# Altium schematic sheet 07_LMS3_Misc.SchDoc: LMS7002M misc (LMS1)
size A3; Organization: Lime Microsystems; Address1: Surrey Tech Centre; Address2: Guildford GU2 7YG; Address3: Surrey; Address4: United Kingdom; Revision: v1.0; SheetNumber: 7; SheetTotal: 31
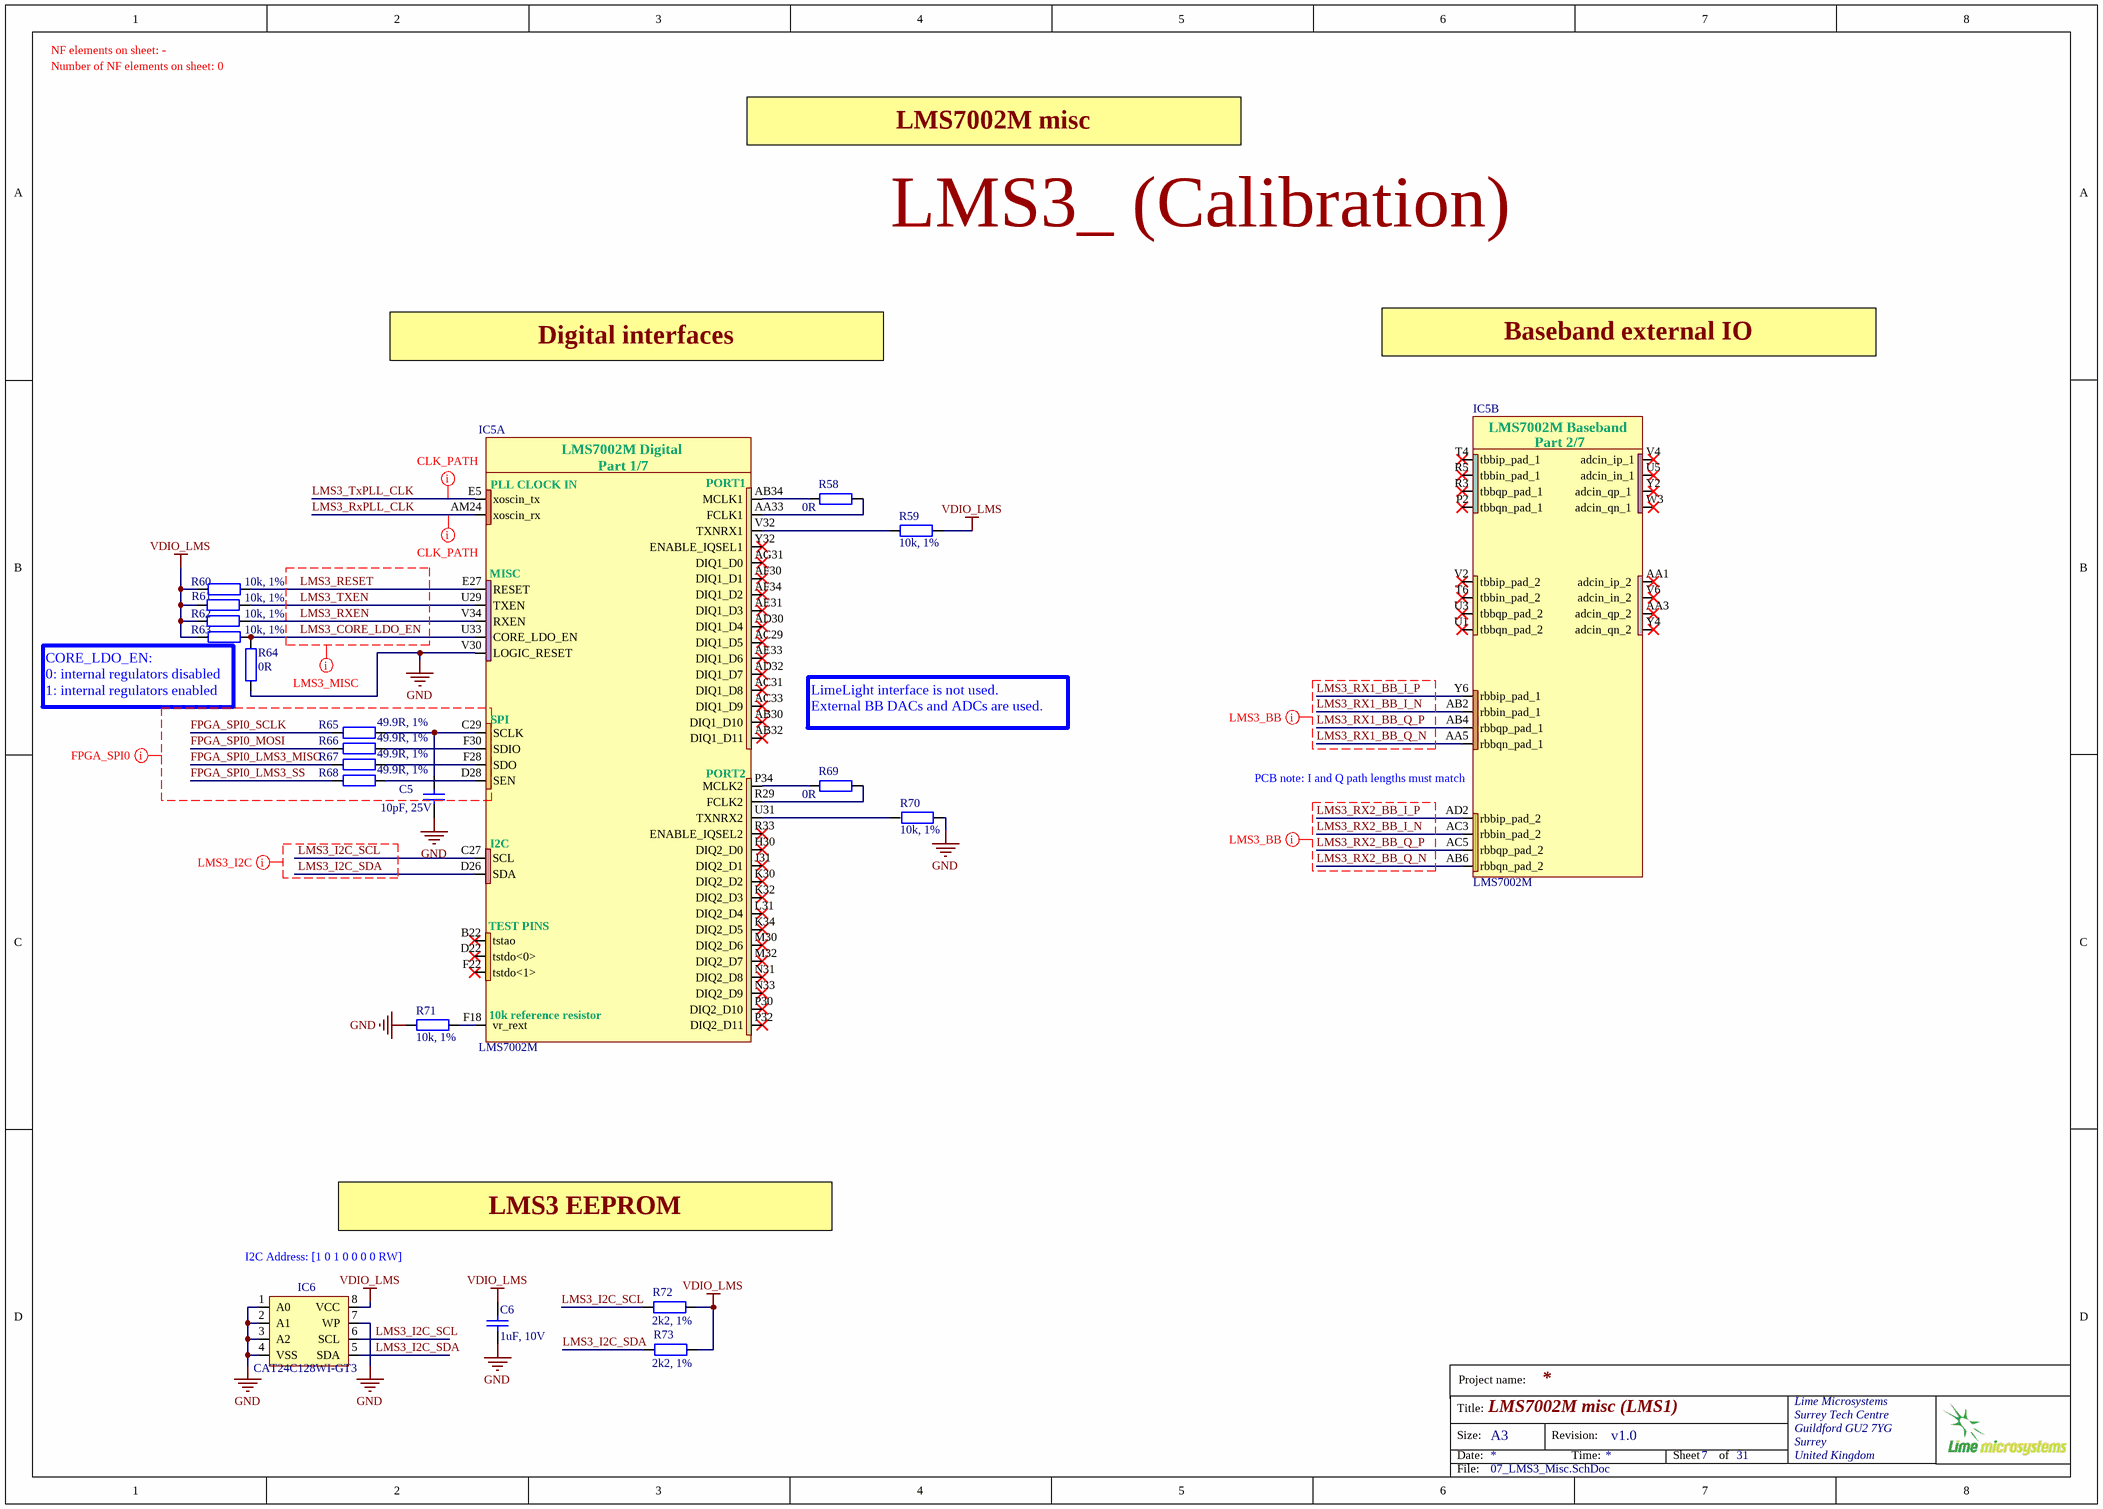
[diagram p0: 07_LMS3_Misc.SchDoc]

## Parts
C5  10pF, 25V  [CAP0402]
C6  1uF, 10V  [CAP0402]
IC5  LMS7002M  [LMS7002M_v5]  (parts A,B of 7)
IC6  CAT24C128WI-GT3  [SOIC127P600-8DL_v2]
R58  0R  [RES0402]
R59  10k, 1%  [RES0402]
R60  10k, 1%  [RES0402]
R61  10k, 1%  [RES0402]
R62  10k, 1%  [RES0402]
R63  10k, 1%  [RES0402]
R64  0R  [RES0402]
R65  49.9R, 1%  [RES0402]
R66  49.9R, 1%  [RES0402]
R67  49.9R, 1%  [RES0402]
R68  49.9R, 1%  [RES0402]
R69  0R  [RES0402]
R70  10k, 1%  [RES0402]
R71  10k, 1%  [RES0402]
R72  2k2, 1%  [RES0402]
R73  2k2, 1%  [RES0402]

## Nets
GND: C5.2 C6.2 IC5.V30(LOGIC_RESET) IC6.1(A0) IC6.2(A1) IC6.3(A2) IC6.4(VSS) IC6.7(WP) R64.1 R70.1 R71.2
VDIO_LMS: C6.1 IC6.8(VCC) R59.2 R60.2 R61.1 R62.1 R63.2 R72.1 R73.1
FPGA_SPI0_LMS3_MISO: R67.2
FPGA_SPI0_LMS3_SS: R68.2
FPGA_SPI0_MOSI: R66.2
FPGA_SPI0_SCLK: R65.2
LMS3_CORE_LDO_EN: IC5.U33(CORE_LDO_EN) R63.1 R64.2
LMS3_I2C_SCL: IC5.C27(SCL) IC6.6(SCL) R72.2
LMS3_I2C_SDA: IC5.D26(SDA) IC6.5(SDA) R73.2
LMS3_RESET: IC5.E27(RESET) R60.1
LMS3_RX1_BB_I_N: IC5.AB2(rbbin_pad_1)
LMS3_RX1_BB_I_P: IC5.Y6(rbbip_pad_1)
LMS3_RX1_BB_Q_N: IC5.AA5(rbbqn_pad_1)
LMS3_RX1_BB_Q_P: IC5.AB4(rbbqp_pad_1)
LMS3_RX2_BB_I_N: IC5.AC3(rbbin_pad_2)
LMS3_RX2_BB_I_P: IC5.AD2(rbbip_pad_2)
LMS3_RX2_BB_Q_N: IC5.AB6(rbbqn_pad_2)
LMS3_RX2_BB_Q_P: IC5.AC5(rbbqp_pad_2)
LMS3_RXEN: IC5.V34(RXEN) R62.2
LMS3_RxPLL_CLK: IC5.AM24(xoscin_rx)
LMS3_TXEN: IC5.U29(TXEN) R61.2
LMS3_TxPLL_CLK: IC5.E5(xoscin_tx)
NetC5_1: C5.1 IC5.C29(SCLK) R65.1
NetIC5_AA33: IC5.AA33(FCLK1) R58.2
NetIC5_AB34: IC5.AB34(MCLK1) R58.1
NetIC5_D28: IC5.D28(SEN) R68.1
NetIC5_F18: IC5.F18(vr_rext) R71.1
NetIC5_F28: IC5.F28(SDO) R67.1
NetIC5_F30: IC5.F30(SDIO) R66.1
NetIC5_P34: IC5.P34(MCLK2) R69.1
NetIC5_R29: IC5.R29(FCLK2) R69.2
NetIC5_U31: IC5.U31(TXNRX2) R70.2
NetIC5_V32: IC5.V32(TXNRX1) R59.1

Not connected (* = marked no-connect by the designer): IC5 AA1(adcin_ip_2_)* AA3(adcin_qp_2_)* AB30(DIQ1_D10)* AB32(DIQ1_D11)* AC29(DIQ1_D5)* AC31(DIQ1_D8)* AC33(DIQ1_D9)* AD30(DIQ1_D4)* AD32(DIQ1_D7)* AE31(DIQ1_D3)* AE33(DIQ1_D6)* AF30(DIQ1_D1)* AF34(DIQ1_D2)* AG31(DIQ1_D0)* B22(tstao)* D22(tstdo<0>)* F22(tstdo<1>)* H30(DIQ2_D0)* J31(DIQ2_D1)* K30(DIQ2_D2)* K32(DIQ2_D3)* K34(DIQ2_D5)* L31(DIQ2_D4)* M30(DIQ2_D6)* M32(DIQ2_D7)* N31(DIQ2_D8)* N33(DIQ2_D9)* P2(tbbqn_pad_1)* P30(DIQ2_D10)* P32(DIQ2_D11)* R3(tbbqp_pad_1)* R5(tbbin_pad_1)* R33(ENABLE_IQSEL2)* T4(tbbip_pad_1)* T6(tbbin_pad_2)* U1(tbbqn_pad_2)* U3(tbbqp_pad_2)* U5(adcin_in_1)* V2(tbbip_pad_2)* V4(adcin_ip_1)* V6(adcin_in_2_)* W3(adcin_qn_1_)* Y2(adcin_qp_1_)* Y4(adcin_qn_2_)* Y32(ENABLE_IQSEL1)*

## Layout directives
net class CLK_PATH: LMS3_RxPLL_CLK, LMS3_TxPLL_CLK
net class FPGA_SPI0: FPGA_SPI0_LMS3_MISO, FPGA_SPI0_LMS3_SS, FPGA_SPI0_MOSI, FPGA_SPI0_SCLK
net class LMS3_I2C: LMS3_I2C_SCL, LMS3_I2C_SDA
net class LMS3_MISC: LMS3_CORE_LDO_EN, LMS3_RESET, LMS3_RXEN, LMS3_TXEN
net class LMS3_BB: LMS3_RX1_BB_I_N, LMS3_RX1_BB_I_P, LMS3_RX1_BB_Q_N, LMS3_RX1_BB_Q_P, LMS3_RX2_BB_I_N, LMS3_RX2_BB_I_P, LMS3_RX2_BB_Q_N, LMS3_RX2_BB_Q_P

## Notes on the sheet
- NF elements on sheet: -
- Number of NF elements on sheet: 0
- LMS7002M misc
- LMS3_ (Calibration)
- Digital interfaces
- Baseband external IO
- (near R63) CORE_LDO_EN:
  0: internal regulators disabled
  1: internal regulators enabled
- LimeLight interface is not used.
  External BB DACs and ADCs are used.
- (near IC5) PCB note: I and Q path lengths must match
- (near IC6) I2C Address: [1 0 1 0 0 0 0 RW]
- LMS3 EEPROM
- Project name:
- Title:
- Size:
- Date:
- A3
- Revision:
- Time:
- Sheet
- of
- File:
- (in symbol LMS7002Mr4, part A) LMS7002M Digital; Part 1/7; PLL CLOCK IN; PORT1; MISC; SPI; PORT2; I2C; TEST PINS; 10k reference resistor
- (in symbol LMS7002Mr4, part B) LMS7002M Baseband; Part 2/7

## Library data of the parts
C5 = Cap_0402: Manufacturer Part Number 1: 04023A100JAT2A; Manufacturer: AVX; Part Description: 10pF ±5% 25V C0G, NP0 Ceramic Capacitor -55°C ~ 125°C Surface Mount, MLCC 0402 (1005 Metric) 0.039" L x 0.020" W (1.00mm x 0.50mm); Capacitance Tolerance: ± 5%; Voltage Rating: 25; Ceramic Capacitor Case: 0402 [1005 Metric]; Capacitor Case Style: 0402 [1005 Metric]<!--FANDB--><div class="features-and-benefits-container"></div>; Dielectric Characteristic: C0G / NP0; SVHC: No SVHC (16-Jun-2014); Capacitance: 10; Value: 10pF, 25V; Supplier 1: Farnell; Supplier Part Number 1: 2332478RL; Product Range: -; RoHS: YES; Operating Temperature Min: -55; Operating Temperature Max: 125; Capacitance Tolerance ±: ± 5%; MSL: MSL 1 - Unlimited; Packaging: Cut Tape
C6 = Cap_0402: Manufacturer Part Number 1: C1005X5R1E105K050BC; Manufacturer: TDK; Part Description: 1µF ±10% 10V X5R Ceramic Capacitor -55°C ~ 85°C Surface Mount, MLCC 0402 (1005 Metric) 0.039" L x 0.020" W (1.00mm x 0.50mm); Voltage Rating: 10; Capacitance Tolerance: ± 10%; Product Range: TDK - C Series; Ceramic Capacitor Case: 0402 [1005 Metric]; Capacitance: 1; Dielectric Characteristic: X6; Value: 1uF, 10V; Supplier 1: Digi-Key; Supplier Part Number 1: 445-9066-1-ND; MSL: -; RoHS: YES
IC5 = LMS7002Mr4: Schematic symbol revision 4. Default footprint - 0.31mm pad; Manufacturer: Lime Microsystems; Part Description: IC FPRF Transceiver LMS7002M; 261 pin aQFN; Supplier 1: Lime Microsystems; Supplier Part Number 1: LMS7002M; Manufacturer Part Number 1: LMS7002M
IC6 = 24FC64F: Part Description: EEPROM Memory IC 128Kb (16K x 8) I²C 1MHz 400ns 8-SOIC; Manufacturer: ON Semiconductor; Memory Type: Non-Volatile; Memory Format: EEPROM; Memory Size: 128Kb (16K x 8); Write Cycle Time - Word, Page: 5ms; Memory Interface: I²C; Voltage - Supply: 1.8 V ~ 5.5 V; Supplier 1: Digi-Key; Supplier Part Number 1: CAT24C128WI-GT3CT-ND; Manufacturer Part Number 1: CAT24C128WI-GT3; RoHS: RoHS Compliant; Category: Integrated Circuits (ICs); Stock 1: 14804; Pricing 1: 1=0.31, 10=0.309, 100=0.2532, 500=0.24616, 1000=0.23956 (USD); Packaging: Cut Tape (CT); Part Status: Active; Technology: EEPROM; Operating Temperature: -40°C ~ 85°C (TA); Mounting Type: Surface Mount; Package / Case: 8-SOIC (0.154", 3.90mm Width); Supplier Device Package: 8-SOIC; Base Part Number: CAT24C128; ComponentLink1URL: http://www.onsemi.com/pub/Collateral/CAT24C128-D.PDF; ComponentLink1Description: http://www.onsemi.com/pub/Collateral/CAT24C128-D.PDF
R58 R64 R69 = Res_0402: Manufacturer Part Number 1: RC0402JR-070RL; Manufacturer: Yageo; Part Description: RES SMD 0.0OHM JUMPER 1/16W 0402; Resistance (Ohms): 0.0; Tolerance: Jumper; Power (Watts): 0.063W, 1/16W; Value: 0R; Supplier 1: Digi-Key; Supplier Part Number 1: 311-0.0JRTR-ND; Category: Resistors; Temperature Coefficient: -; Features: Moisture Resistant; Supplier Device Package: 0402; Height: 0.016" (0.40mm); Package / Case: 0402 (1005 Metric); Operating Temperature: -55°C ~ 155°C; Size / Dimension: 0.039" L x 0.020" W (1.00mm x 0.50mm); Composition: Thick Film; Packaging: Tape & Reel (TR); Number of Terminations: 2; RoHS: RoHS Compliant
R59-R63 R70 R71 = Res_0402: Manufacturer: Yageo; Manufacturer Part Number 1: RC0402FR-0710KL; Part Description: RES SMD 10K OHM 1% 1/16W 0402; Temperature Coefficient: ±100ppm/°C; Power (Watts): 0.063W, 1/16W; Value: 10k, 1%; Supplier 1: Digi-Key; Supplier Part Number 1: 311-10.0KLRTR-ND; Resistance (Ohms): 10k; Packaging: Tape & Reel (TR); RoHS: RoHS Compliant; Package / Case: 0402 (1005 Metric); Tolerance: ±1%; Operating Temperature: -55°C ~ 155°C; Size / Dimension: 0.039" L x 0.020" W (1.00mm x 0.50mm); Number of Terminations: 2; Category: Resistors; Height: 0.016" (0.40mm); Supplier Device Package: 0402; Features: Moisture Resistant; Composition: Thick Film
R65-R68 = Res_0402: Manufacturer: Samsung Electro-Mechanics America, Inc.; Manufacturer Part Number: RC1005F49R9CS; Part Description: RES SMD 49.9 OHM 1% 1/16W 0402; Temperature Coefficient: ±100ppm/°C; Resistance (Ohms): 49.9; Power (Watts): 0.063W, 1/16W; Number of Terminations: 2; Size / Dimension: 0.039" L x 0.020" W (1.00mm x 0.50mm); Supplier Device Package: 0402 (1005 Metric); RoHS: RoHS Compliant; Supplier Part Number 1: 1276-3469-6-ND; Features: -; Packaging: Digi-Reel®; Tolerance: ±1%; Height: 0.016" (0.40mm); Category: Resistors; Composition: Thick Film; Package / Case: 0402 (1005 Metric); Supplier 1: Digi-Key; Operating Temperature: -55°C ~ 155°C; Value: 49.9R, 1%; Manufacturer Part Number 1: RC1005F49R9CS
R72 R73 = Res_0402: Manufacturer: Stackpole Electronics Inc; Manufacturer Part Number 1: RMCF0402FT2K20; Part Description: RES SMD 2.2K OHM 1% 1/16W 0402; Resistance (Ohms): 2.2k; Temperature Coefficient: ±100ppm/°C; Power (Watts): 0.063W, 1/16W; Value: 2k2, 1%; Supplier 1: Digi-Key; Supplier Part Number 1: RMCF0402FT2K20CT-ND; Supplier Device Package: 0402; Package / Case: 0402 (1005 Metric); Size / Dimension: 0.039" L x 0.020" W (1.00mm x 0.50mm); Operating Temperature: -55°C ~ 155°C; Composition: Thick Film; Category: Resistors; Features: -; Height: 0.016" (0.40mm); RoHS: RoHS Compliant; Number of Terminations: 2; Packaging: Cut Tape (CT); Tolerance: ±1%